# EAGLE design Keyglove Kit v0.3 (EAGLE 6.1)
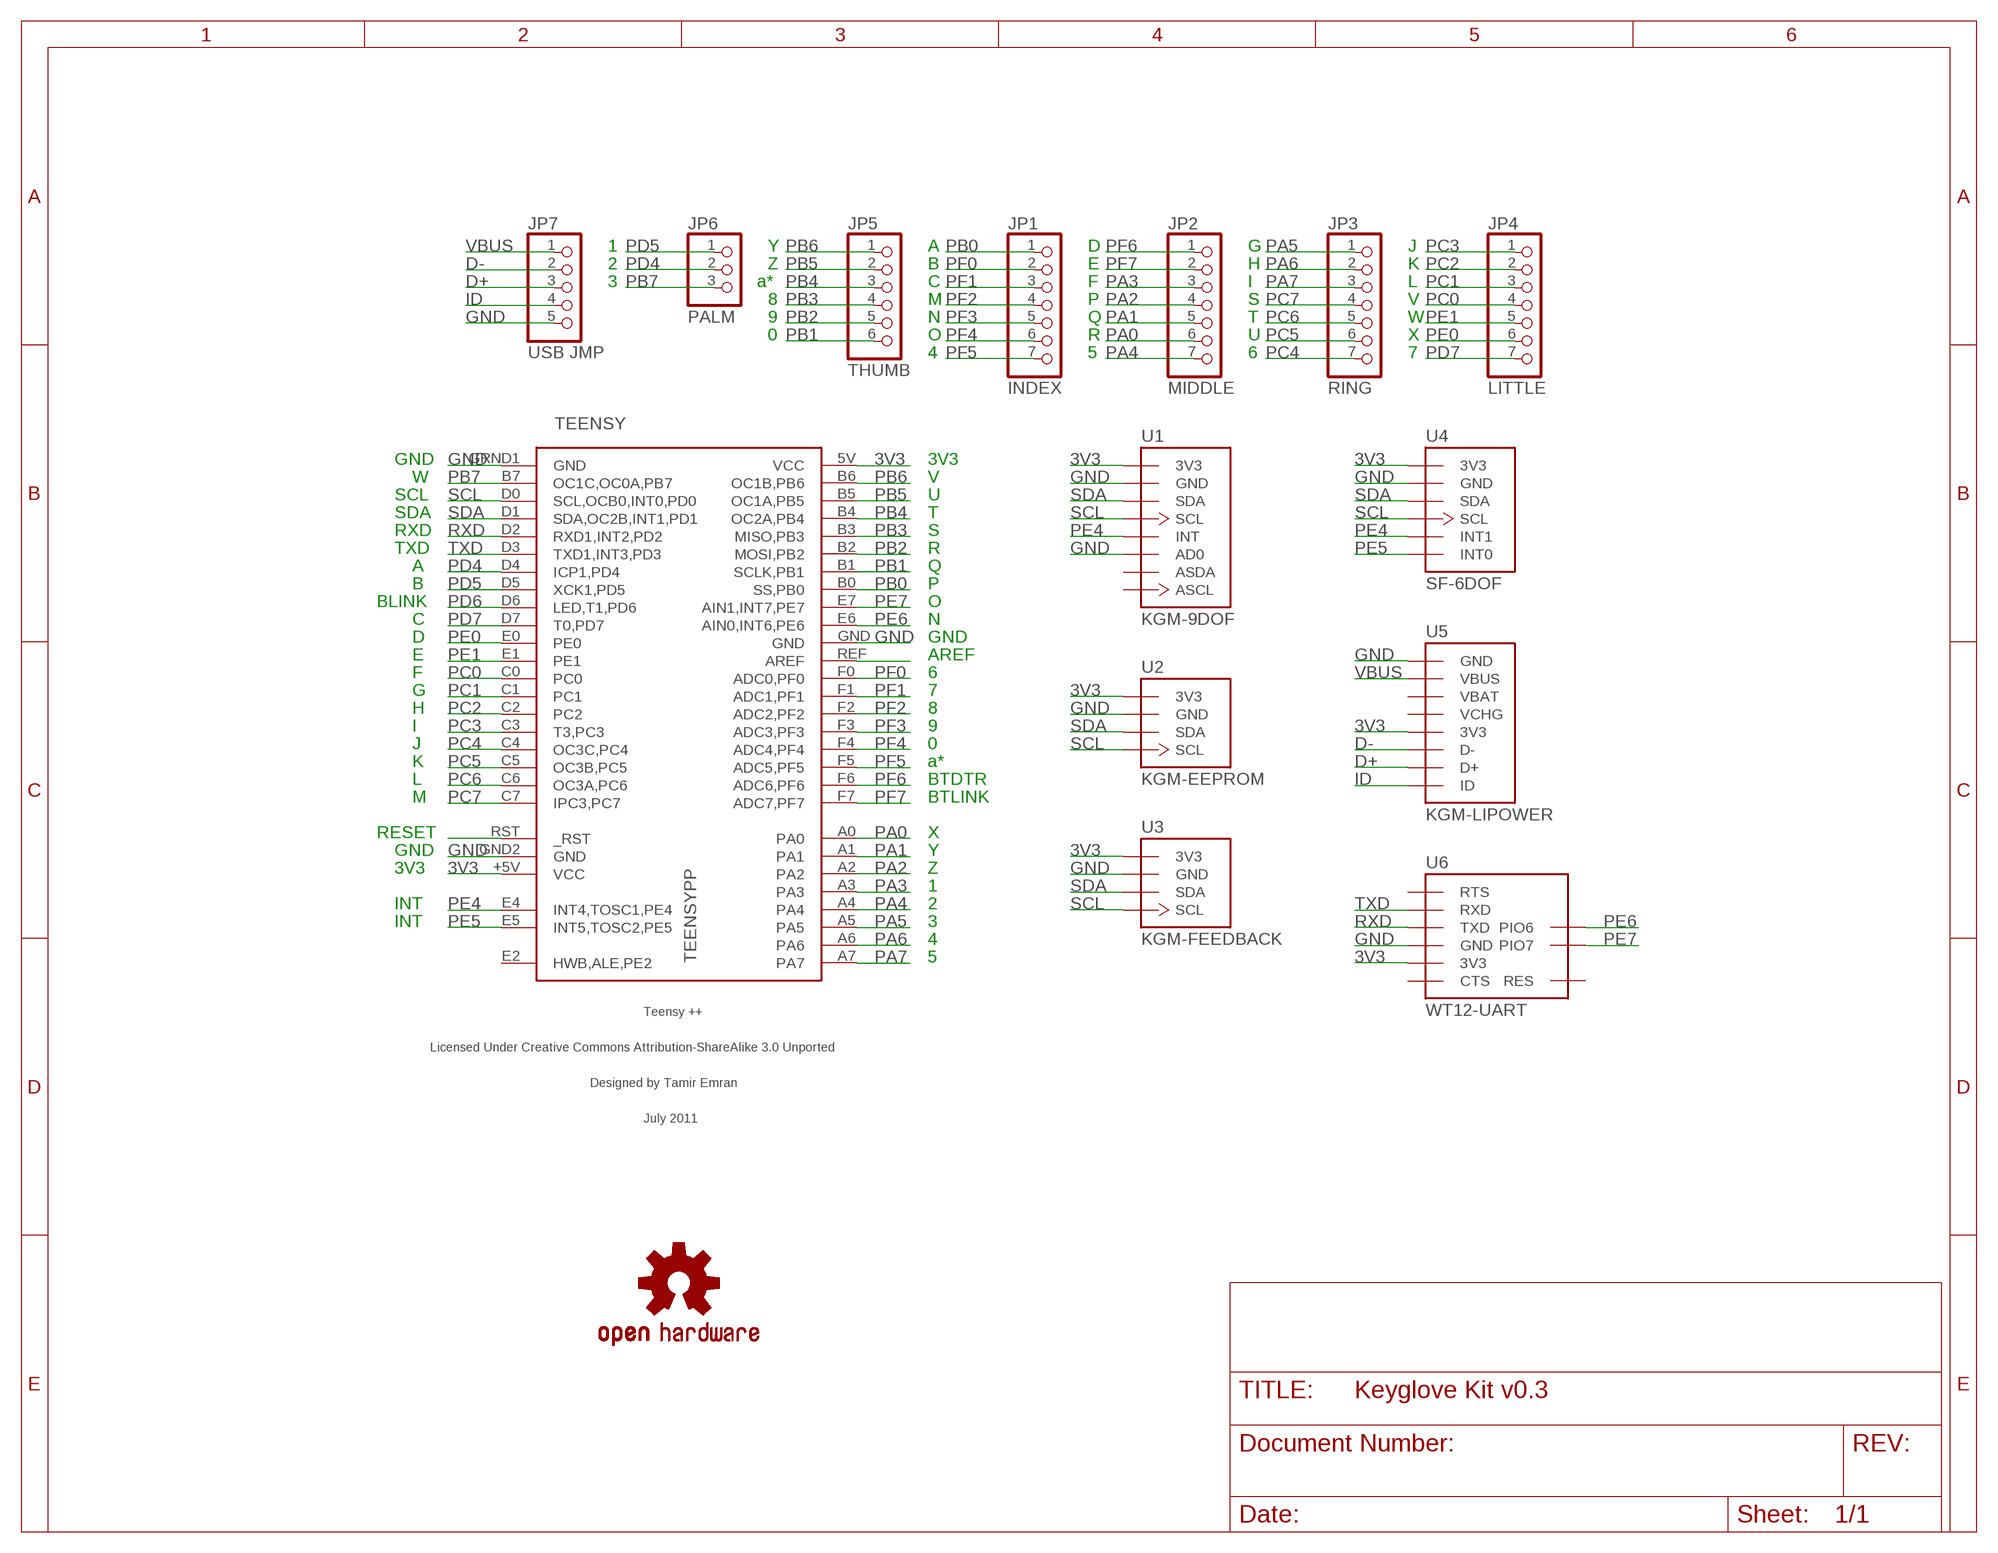
[diagram p0: schematic, sheet 1]

## Parts
JP1  INDEX  PINHD-1X7  [1X07]
JP2  MIDDLE  PINHD-1X7  [1X07]
JP3  RING  PINHD-1X7  [1X07]
JP4  LITTLE  PINHD-1X7  [1X07]
JP5  THUMB  PINHD-1X6  [1X06]
JP6  PALM  PINHD-1X3  [1X03]
JP7  USB JMP  PINHD-1X5  [1X05]
TEENSY  TEENSYPP  [TEENSYPP]
U1  KGM-9DOF  [KGM-9DOF]
U2  KGM-EEPROM  [KGM-EEPROM]
U3  KGM-FEEDBACK  [KGM-FEEDBACK]
U4  SF-6DOF  [SF-6DOF]
U5  KGM-LIPOWER  [KGM-LIPOWER]
U6  WT12-UART  [WT12-UART]
U$1  OSHW-LOGOM  [OSHW-LOGO-M]

## Nets
3V3 [power]: TEENSY.5V(VCC) TEENSY.+5V(VCC) U1.3V3 U2.3V3 U3.3V3 U4.3V3 U5.3V3 U6.3V3
D+: JP7.3 U5.D+
D-: JP7.2 U5.D-
GND [power]: JP7.5 TEENSY.GND TEENSY.GND2(GND) TEENSY.GRND1(GND) U1.AD0 U1.GND U2.GND U3.GND U4.GND U5.GND U6.GND
ID: JP7.4 U5.ID
N$107: TEENSY.RST(_RST)
N$128: TEENSY.REF(AREF)
PA0: JP2.6 TEENSY.A0
PA1: JP2.5 TEENSY.A1
PA2: JP2.4 TEENSY.A2
PA3: JP2.3 TEENSY.A3
PA4: JP2.7 TEENSY.A4
PA5: JP3.1 TEENSY.A5
PA6: JP3.2 TEENSY.A6
PA7: JP3.3 TEENSY.A7
PB0: JP1.1 TEENSY.B0(SS,PB0)
PB1: JP5.6 TEENSY.B1(SCLK,PB1)
PB2: JP5.5 TEENSY.B2(MOSI,PB2)
PB3: JP5.4 TEENSY.B3(MISO,PB3)
PB4: JP5.3 TEENSY.B4(OC2A,PB4)
PB5: JP5.2 TEENSY.B5(OC1A,PB5)
PB6: JP5.1 TEENSY.B6(OC1B,PB6)
PB7: JP6.3 TEENSY.B7(OC1C,OC0A,PB7)
PC0: JP4.4 TEENSY.C0
PC1: JP4.3 TEENSY.C1
PC2: JP4.2 TEENSY.C2
PC3: JP4.1 TEENSY.C3(T3,PC3)
PC4: JP3.7 TEENSY.C4(OC3C,PC4)
PC5: JP3.6 TEENSY.C5(OC3B,PC5)
PC6: JP3.5 TEENSY.C6(OC3A,PC6)
PC7: JP3.4 TEENSY.C7(IPC3,PC7)
PD4: JP6.2 TEENSY.D4(ICP1,PD4)
PD5: JP6.1 TEENSY.D5(XCK1,PD5)
PD6: TEENSY.D6(LED,T1,PD6)
PD7: JP4.7 TEENSY.D7(T0,PD7)
PE0: JP4.6 TEENSY.E0
PE1: JP4.5 TEENSY.E1
PE4: TEENSY.E4(INT4,TOSC1,PE4) U1.INT U4.INT1
PE5: TEENSY.E5(INT5,TOSC2,PE5) U4.INT0
PE6: TEENSY.E6(AIN0,INT6,PE6) U6.PIO6
PE7: TEENSY.E7(AIN1,INT7,PE7) U6.PIO7
PF0: JP1.2 TEENSY.F0(ADC0,PF0)
PF1: JP1.3 TEENSY.F1(ADC1,PF1)
PF2: JP1.4 TEENSY.F2(ADC2,PF2)
PF3: JP1.5 TEENSY.F3(ADC3,PF3)
PF4: JP1.6 TEENSY.F4(ADC4,PF4)
PF5: JP1.7 TEENSY.F5(ADC5,PF5)
PF6: JP2.1 TEENSY.F6(ADC6,PF6)
PF7: JP2.2 TEENSY.F7(ADC7,PF7)
RXD: TEENSY.D2(RXD1,INT2,PD2) U6.TXD
SCL: TEENSY.D0(SCL,OCB0,INT0,PD0) U1.SCL U2.SCL U3.SCL U4.SCL
SDA: TEENSY.D1(SDA,OC2B,INT1,PD1) U1.SDA U2.SDA U3.SDA U4.SDA
TXD: TEENSY.D3(TXD1,INT3,PD3) U6.RXD
VBUS [power]: JP7.1 U5.VBUS
Unconnected: TEENSY.E2(HWB,ALE,PE2) U1.ASCL U1.ASDA U6.CTS U6.RESET(RES) U6.RTS

## Notes on the sheet
- 1 | Y | A | D | G | J
- 2 | Z | B | E | H | K
- 3 | a* | C | F | I | L
- 8 | M | P | S | V
- 9 | N | Q | T | W
- 0 | O | R | U | X
- 4 | 5 | 6 | 7
- GND | 3V3
- W | V
- SCL | U
- SDA | T
- RXD | S
- TXD | R
- A | Q
- B | P
- BLINK | O
- C | N
- D | GND
- E | AREF
- F | 6
- G | 7
- H | 8
- I | 9
- J | 0
- K | a*
- L | BTDTR
- M | BTLINK
- RESET | X
- GND | Y
- 3V3 | Z
- 1
- INT | 2
- INT | 3
- 4
- 5

## Power pins joined to a net without a drawn wire
VBAT: U5.VBAT
VCHG: U5.VCHG

## Library data of the parts
JP1-JP4 = sf-pinhead:PINHD-1X7: PIN HEADER
JP5 = sf-pinhead:PINHD-1X6: PIN HEADER
JP6 = sf-pinhead:PINHD-1X3: PIN HEADER
JP7 = sf-pinhead:PINHD-1X5: PIN HEADER
TEENSY = sf-keyglovekit:TEENSYPP: Teensy++ Teensy++ board by PJRC <http://www.pjrc.com/>. Eagle part designed by Tamir Emran, July 2011. Licensed under Create Commons Attribution-ShareAlike 3.0 Unported license (CC-BY-SA-3.0).
U1 = sf-keyglovekit:KGM-9DOF
U2 = sf-keyglovekit:KGM-EEPROM
U3 = sf-keyglovekit:KGM-FEEDBACK
U4 = sf-keyglovekit:SF-6DOF
U5 = sf-keyglovekit:KGM-LIPOWER
U6 = sf-keyglovekit:WT12-UART
U$1 = SparkFun:OSHW-LOGO: Open Source Hardware Logo This logo indicates the piece of hardware it is found on incorporates a OSHW license and/or adheres to the definition of open source hardware found here: http://freedomdefined.org/OSHW

## Net classes
0 default: width 0.152 mm, drill 0.33 mm, clearance 0.152 mm
1 power: width 0.203 mm, drill 0.33 mm, clearance 0.152 mm

## Board
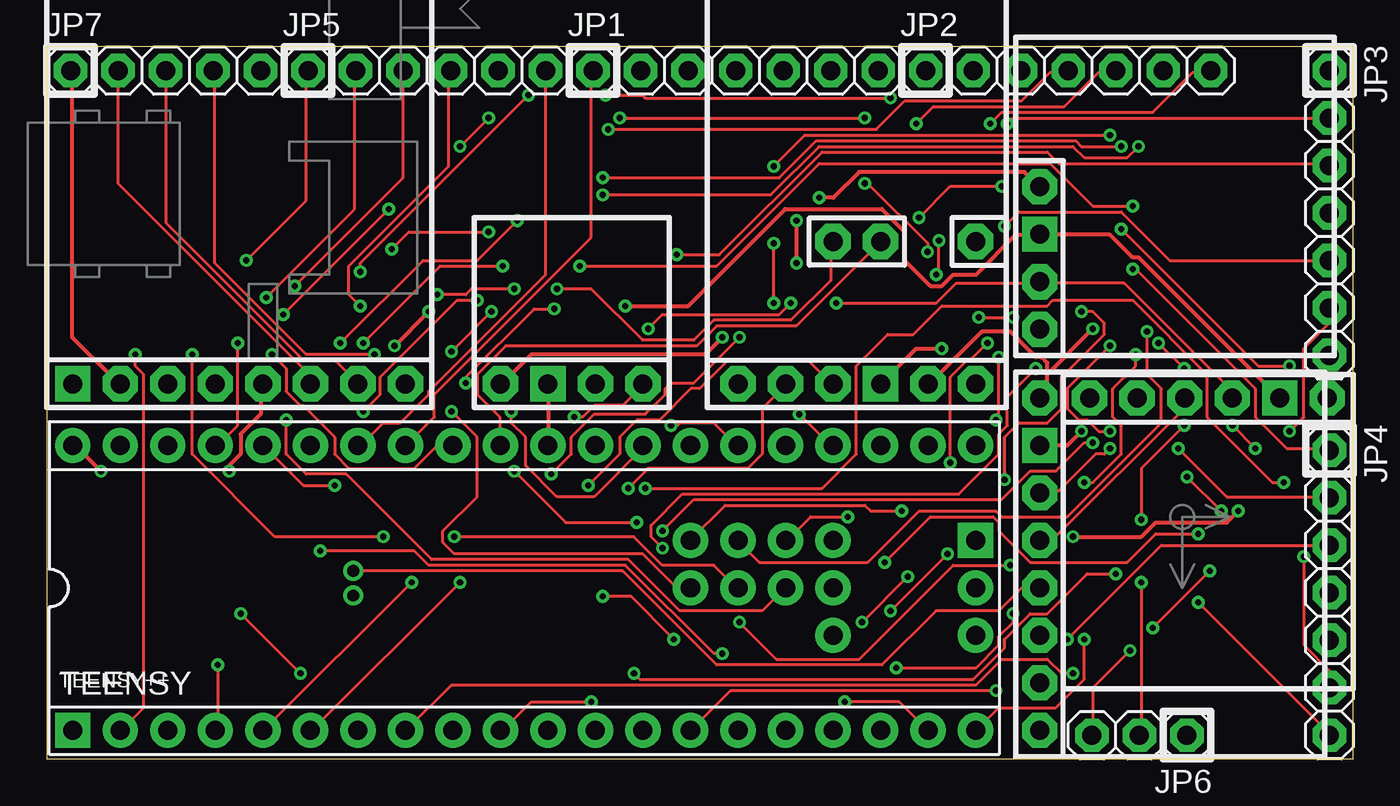
[diagram p1: board, top side]
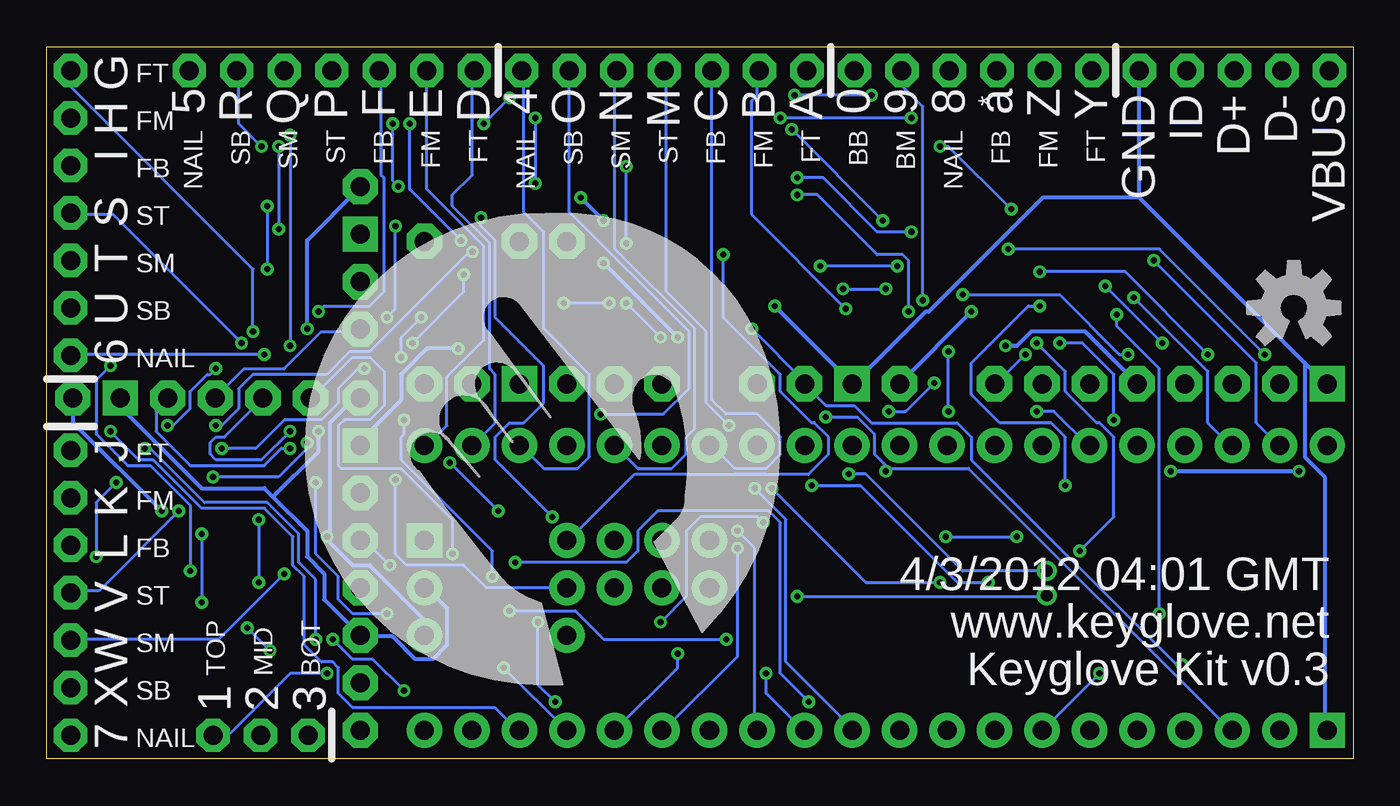
[diagram p2: board, bottom side, seen from below]

Size 69.85 x 38.1 mm. Coordinates in mm from the lower left corner, seen from the top.
Outline: 0,38.1 0,0 69.85,0 69.85,38.1 0,38.1
Copper layers (1*16): Top 0.0356mm / dielectric 1.5011mm / Bottom 0.0356mm
Design rules: minimum track width 6mil, minimum drill 13mil, track to track 6mil, track to pad 6mil, pad to pad 6mil, via to via 6mil, smd to smd 6mil, copper to edge 15mil, drill to drill 6mil, minimum pad ring 7mil, minimum via ring 7mil, stop-mask expansion 4mil, vias tented up to drill 20mil, thermal gap 10mil

### Footprints (pad centres in the part's own frame; a part is rotated, then mirrored left to right if it is on the bottom)
1X07 = drill 1.016 pad 1.778 octagon: 1 -7.62,0; 2 -5.08,0; 3 -2.54,0; 4 0,0; 5 2.54,0; 6 5.08,0; 7 7.62,0
1X06 = drill 1.016 pad 1.778 octagon: 1 -6.35,0; 2 -3.81,0; 3 -1.27,0; 4 1.27,0; 5 3.81,0; 6 6.35,0
1X03 = drill 1.016 pad 1.778 octagon: 1 -2.54,0; 2 0,0; 3 2.54,0
1X05 = drill 1.016 pad 1.778 octagon: 1 -5.08,0; 2 -2.54,0; 3 0,0; 4 2.54,0; 5 5.08,0
TEENSYPP = drill 1.016 pad 1.88: 5V 24.13,-2.54; +5V -24.13,7.62; A0 8.89,0; A1 11.43,0; A2 13.97,0; A3 16.51,0; A4 8.89,2.54; A5 11.43,2.54; A6 13.97,2.54; A7 16.51,2.54; B0 -6.35,7.62; B1 -8.89,7.62; B2 -11.43,7.62; B3 -13.97,7.62; B4 -16.51,7.62; B5 -19.05,7.62; B6 -21.59,7.62; B7 -21.59,-7.62; C0 6.35,-7.62; C1 8.89,-7.62; C2 11.43,-7.62; C3 13.97,-7.62; C4 16.51,-7.62; C5 19.05,-7.62; C6 21.59,-7.62; C7 24.13,-7.62; D0 -19.05,-7.62; D1 -16.51,-7.62; D2 -13.97,-7.62; D3 -11.43,-7.62; D4 -8.89,-7.62; D5 -6.35,-7.62; D6 -3.81,-7.62; D7 -1.27,-7.62; E0 1.27,-7.62; E1 3.81,-7.62; E2 16.51,-2.54; E6 -1.27,7.62; E7 -3.81,7.62; F0 6.35,7.62; F1 8.89,7.62; F2 11.43,7.62; F3 13.97,7.62; F4 16.51,7.62; F5 19.05,7.62; F6 21.59,7.62; F7 24.13,7.62; GND2 24.13,0; GRND1 1.27,7.62; REF 3.81,7.62 | drill 0.635 pad 1.067: E4 -9.144,0.914; E5 -9.144,-0.406 | drill 1.016 pad 1.88 square: GND -24.13,-7.62; RST 24.13,2.54
KGM-9DOF = drill 1.016 pad 1.88 octagon: 3V3 1.27,19.177; AD0 1.27,6.477; ASCL 1.27,1.397; ASDA 1.27,3.937; INT 1.27,9.017; SCL 1.27,11.557; SDA 1.27,14.097 | drill 1.016 pad 1.88 square: GND 1.27,16.637
KGM-EEPROM = drill 1.016 pad 1.88 octagon: 3V3 1.27,9.017; SCL 1.27,1.397; SDA 1.27,3.937 | drill 1.016 pad 1.88 square: GND 1.27,6.477
KGM-FEEDBACK = drill 1.016 pad 1.88 octagon: 3V3 1.27,9.017; SCL 1.27,1.397; SDA 1.27,3.937 | drill 1.016 pad 1.88 square: GND 1.27,6.477
SF-6DOF = drill 1.016 pad 1.88 octagon: 3V3 1.27,14.097; INT0 1.27,1.397; INT1 1.27,3.937; SCL 1.27,6.477; SDA 1.27,9.017 | drill 1.016 pad 1.88 square: GND 1.27,11.557
KGM-LIPOWER = drill 1.016 pad 1.88 octagon: 3V3 1.27,9.017; D+ 1.27,3.937; D- 1.27,6.477; ID 1.27,1.397; VBAT 1.27,14.097; VBUS 1.27,16.637; VCHG 1.27,11.557 | drill 1.016 pad 1.88 square: GND 1.27,19.177
WT12-UART = drill 1.016 pad 1.88 octagon: 3V3 1.27,4.191; CTS 1.27,1.651; PIO6 8.89,6.731; PIO7 8.89,9.271; RESET 8.89,1.651; RTS 1.27,14.351; RXD 1.27,11.811; TXD 1.27,9.271 | drill 1.016 pad 1.88 square: GND 1.27,6.731

### Placement (x,y rotation side)
JP1  36.83,36.83 0 top
JP2  54.61,36.83 0 top
JP3  68.58,29.21 270 top
JP4  68.58,8.89 270 top
JP5  20.32,36.83 0 top
JP6  58.42,1.27 180 top
JP7  6.35,36.83 0 top
TEENSY  25.53,9.14 0 top
U1  51.82,0.13 0 top
U2  33.27,18.8 90 top
U3  51.82,21.59 0 top
U4  54.36,20.57 270 top
U5  20.57,18.8 90 top
U6  51.31,18.8 90 top
U$1  3.17,24.13 0 bottom

### Tracks (layer width: path | path; a pad name or v marks a point on that pad's centre or on a via)
3V3  (via drill 0.33)
  Top 0.203: v2.9,15.39 1.52,16.76 TEENSY.+5V | v9.75,15.39 9.75,15.7 10.36,16.31 10.36,17.37 11.43,18.44 11.43,19.96 U5.3V3 | v18.59,22.1 v20.42,23.93 | 53.19,30.63 U3.3V3 53.03,30.63 52.27,31.39 43.43,31.39 42.06,30.02 v41.3,30.02 | 53.49,20.57 53.49,19.66 53.19,19.36 U1.3V3 | 53.49,20.57 53.49,21.18 53.19,21.49 52.88,21.49 51.51,22.86 49.99,22.86 47.24,20.12 U6.3V3 | v63.7,13.26 63.09,12.65 59.28,12.65 58.52,11.89 v54.86,11.89 | 53.49,20.57 v55.93,23.01 | v36.12,22.55 35.2,21.64 25.91,21.64 24.38,20.12 U2.3V3 | v40.08,28.8 v40.08,26.52
  Bottom 0.203: v9.75,15.39 v2.9,15.39 | v20.42,23.93 24.23,20.12 U2.3V3 | v18.59,22.1 17.98,22.1 17.22,22.86 14.33,22.86 11.58,20.12 U5.3V3 | 54.71,11.89 54.71,17.98 53.49,19.2 53.19,19.2 U1.3V3 | 54.71,11.89 54.71,11.58 53.49,10.36 52.58,10.36 49.68,7.47 49.68,6.71 TEENSY.5V | v63.7,13.26 68.43,17.98 68.43,19.2 U4.3V3 | 54.71,11.89 v54.86,11.89 | v55.93,23.01 55.93,27.74 53.19,30.48 U3.3V3 | v40.08,26.52 v36.12,22.55 | v41.3,30.02 v40.08,28.8
D+
  Top 0.152: JP7.3 6.4,36.73 6.4,28.65 13.72,21.34 15.39,21.34 16.61,20.12 U5.D+
D-
  Top 0.152: JP7.2 3.81,30.79 14.02,20.57 14.02,20.12 U5.D-
GND  (via drill 0.33)
  Top 0.203: v47.85,21.95 46.48,21.95 44.65,20.12 U6.GND | 49.68,9.14 TEENSY.GND2 | U4.GND 65.84,19.36 58.37,26.82 58.06,26.82 56.84,28.04 53.19,28.04 U3.GND 53.03,28.04 51.82,28.04 49.68,25.91 48.46,25.91 47.85,25.3 47.24,25.3 45.87,26.67 45.87,28.19 44.65,29.41 39.47,29.41 34.29,24.23 v30.94,24.23 | U1.GND 54.56,16.76 v55.32,17.53 | TEENSY.GRND1 26.82,16.76 26.82,19.96 U2.GND | 1.52,1.52 TEENSY.GND
  Bottom 0.203: v47.85,21.95 49.53,21.95 50.9,20.57 50.9,19.2 53.03,17.07 53.03,16.76 U1.GND | TEENSY.GND2 49.53,9.14 48.46,8.08 48.46,6.1 49.23,5.33 50.14,5.33 51.36,6.55 53.03,6.55 U1.AD0 55.02,8.53 55.02,9.91 55.93,10.82 55.93,12.19 57.76,14.02 | 57.76,14.02 58.22,14.48 61.57,14.48 65.84,18.75 65.84,19.2 U4.GND | v55.32,17.53 55.32,16.46 57.76,14.02 | 11.43,30.02 JP7.5 | 2.59,21.18 1.52,20.12 U5.GND | 2.59,21.18 11.43,30.02 | 2.59,21.18 2.59,16.15 1.52,15.09 1.52,1.52 TEENSY.GND | 11.43,30.02 16.61,30.02 22.71,23.93 22.86,23.93 26.67,20.12 U2.GND 26.82,20.12 v30.94,24.23
ID  (via drill 0.33)
  Top 0.152: v17.53,21.64 13.87,21.64 8.99,26.52 8.99,36.73 JP7.4
  Bottom 0.152: v17.53,21.64 19.05,20.12 U5.ID
PA0  (via drill 0.33)
  Top 0.152: v58.37,32.77 57.76,32.16 55.47,32.16 54.86,32.77 41.3,32.77 38.71,30.18 v29.72,30.18 | v21.64,21.79 v23.77,23.93 | v21.64,18.59 23.01,17.22 23.01,14.02 21.18,12.19 21.18,11.58 21.79,10.97 31.85,10.97 33.68,9.14 TEENSY.A0
  Bottom 0.152: v58.37,32.77 59.59,33.98 59.59,36.73 JP2.6 | v29.72,30.18 28.65,30.18 25.45,26.98 24.08,26.98 23.77,26.67 v23.77,23.93 | v21.64,18.59 v21.64,21.79
PA1  (via drill 0.33)
  Top 0.152: v46.48,33.98 47.4,34.9 54.41,34.9 56.24,36.73 57.15,36.73 JP2.5 | v45.11,35.36 32,35.36 31.85,35.51 v29.87,35.51 | v25.76,35.51 16.76,26.52 v16.76,26.06 | v7.77,21.64 7.77,16.31 12.19,11.89 v17.98,11.89 | v21.79,11.89 31.39,11.89 32.92,10.36 35.66,10.36 36.88,9.14 TEENSY.A1
  Bottom 0.152: v45.11,35.36 v46.48,33.98 | v25.76,35.51 v29.87,35.51 | v16.76,26.06 12.19,26.06 v7.77,21.64 | v21.79,11.89 v17.98,11.89
PA2  (via drill 0.33)
  Top 0.152: v30.02,33.68 44.35,33.68 45.87,35.2 52.12,35.2 53.65,36.73 54.56,36.73 JP2.4 | v25.15,28.8 23.01,26.67 20.12,26.67 v15.7,22.25 | v12.8,18.14 12.8,16.31 13.87,15.24 16,15.24 20.57,10.67 31.09,10.67 33.83,7.92 38.25,7.92 39.47,9.14 TEENSY.A2
  Bottom 0.152: v25.15,28.8 v30.02,33.68 | v15.7,22.25 14.48,22.25 12.8,20.57 v12.8,18.14
PA3  (via drill 0.33)
  Top 0.152: v55.32,23.93 55.93,23.93 56.54,23.32 56.54,22.71 54.25,20.42 54.25,18.75 53.49,17.98 51.97,17.98 51.21,17.22 v51.21,14.94
  Bottom 0.152: v55.32,23.93 55.02,24.23 52.58,24.23 51.82,24.99 51.82,31.09 51.97,31.24 51.97,36.73 JP2.3 | v51.21,14.94 51.21,10.97 50.6,10.36 47.55,10.36 46.33,9.14 TEENSY.A3
PA4  (via drill 0.33)
  Top 0.152: v50.44,33.98 51.05,34.59 59.13,34.59 61.27,36.73 62.18,36.73 JP2.7 | v47.7,27.74 47.7,26.06 v47.55,25.91 | v50.29,22.25 49.38,21.34 49.23,21.34 48.31,20.42 v48.31,15.85 | v45.72,13.26 44.04,13.26 43.74,13.56 36.27,13.56 34.44,11.73 TEENSY.A4
  Bottom 0.152: v50.44,33.98 50.44,30.48 v47.7,27.74 | v47.55,25.91 47.55,24.99 v50.29,22.25 | v45.72,13.26 v48.31,15.85
PA5  (via drill 0.33)
  Top 0.152: v58.83,22.86 58.83,20.57 59.59,19.81 59.59,17.98 54.56,12.95 51.05,12.95 50.75,13.26 46.63,13.26 43.89,10.52 38.1,10.52 37.03,11.58 TEENSY.A5
  Bottom 0.152: JP3.1 68.58,35.97 58.83,26.21 v58.83,22.86
PA6  (via drill 0.33)
  Top 0.152: JP3.2 51.66,34.29 v51.36,33.98 | v51.05,30.63 48.31,30.63 v46.63,28.96 | v42.82,12.95 40.84,12.95 39.62,11.73 TEENSY.A6
  Bottom 0.152: v51.36,33.98 51.36,30.94 v51.05,30.63 | v46.63,28.96 46.63,28.5 45.87,27.74 45.87,23.62 43.28,21.03 43.28,19.05 44.35,17.98 45.11,17.98 45.87,17.22 45.87,16 v42.82,12.95
PA7  (via drill 0.33)
  Top 0.152: v33.68,26.98 35.97,26.98 41.45,32.46 53.49,32.46 54.1,31.85 68.58,31.85 JP3.3
  Bottom 0.152: v33.68,26.98 33.68,23.62 30.63,20.57 30.63,19.66 28.96,17.98 28.8,17.98 28.04,17.22 28.04,16.31 29.11,15.24 38.41,15.24 41.91,11.73 TEENSY.A7
PB0
  Top 0.152: JP1.1 29.11,36.73 29.11,27.89 20.73,19.51 20.73,18.29 19.2,16.76 TEENSY.B0
PB1
  Top 0.152: JP5.6 26.67,25.91 20.42,19.66 20.42,19.51 18.9,17.98 17.98,17.98 16.76,16.76 TEENSY.B1
PB2  (via drill 0.33)
  Top 0.152: v23.01,24.54 21.95,24.54 17.83,20.42 17.83,19.51 v16.92,18.59
  Bottom 0.152: v23.01,24.54 23.01,34.9 24.08,35.97 24.08,36.73 JP5.5 | v16.92,18.59 16,18.59 14.17,16.76 TEENSY.B2
PB3  (via drill 0.33)
  Top 0.152: v16.76,24.23 16.15,24.84 16.15,26.36 21.49,31.7 21.49,36.73 JP5.4 | v15.39,14.63 13.72,14.63 11.58,16.76 TEENSY.B3
  Bottom 0.152: v16.76,24.23 17.37,24.23 20.42,21.18 20.42,19.51 18.9,17.98 16.15,17.98 15.39,17.22 v15.39,14.63
PB4  (via drill 0.33)
  Top 0.152: JP5.3 19.05,31.09 v13.26,25.3 | v10.21,22.25 10.21,17.83 9.14,16.76 TEENSY.B4
  Bottom 0.152: v10.21,22.25 v13.26,25.3
PB5  (via drill 0.33)
  Top 0.152: v11.73,24.69 16.46,29.41 16.46,36.73 JP5.2
  Bottom 0.152: v11.73,24.69 7.77,20.73 7.77,17.98 6.55,16.76 TEENSY.B5
PB6  (via drill 0.33)
  Top 0.152: v10.67,26.67 13.87,29.87 13.87,36.73 JP5.1
  Bottom 0.152: v10.67,26.67 5.18,21.18 5.18,17.98 3.96,16.76 TEENSY.B6
PB7  (via drill 0.33)
  Top 0.152: v57.91,5.79 55.93,3.81 55.93,1.37 JP6.3 | v62.18,10.06 v59.13,7.01 | v66.45,21.03 64.77,21.03 v57.45,28.35 | v57.45,32.77 55.32,32.77 55.02,33.07 41.15,33.07 39.17,31.09 v29.72,31.09 | v23.62,28.19 19.36,28.19 v18.44,27.28 | v4.72,21.64 4.72,21.03 5.18,20.57 5.18,2.74 3.96,1.52 TEENSY.B7
  Bottom 0.152: v59.13,7.01 v57.91,5.79 | v62.18,10.06 62.18,13.56 64.31,15.7 65.53,15.7 67.21,17.37 67.21,20.27 v66.45,21.03 | v57.45,32.77 v57.45,28.35 | v29.72,31.09 28.35,31.09 25.45,28.19 v23.62,28.19 | v18.44,27.28 10.36,27.28 v4.72,21.64
PC0  (via drill 0.33)
  Top 0.152: v60.96,15.09 v62.79,13.26 | v55.93,16.92 55.47,16.92 53.95,15.39 52.58,15.39 51.05,13.87 34.59,13.87 v32.92,12.19
  Bottom 0.152: v62.79,13.26 67.06,8.99 68.58,8.99 JP4.4 | v60.96,15.09 57.45,15.09 55.93,16.61 v55.93,16.92 | v32.92,12.19 32,11.28 32,1.52 TEENSY.C0
PC1  (via drill 0.33)
  Top 0.152: JP4.3 59.59,11.43 v54.56,6.4 | v50.75,3.66 36.58,3.66 34.44,1.52 TEENSY.C1
  Bottom 0.152: v54.56,6.4 53.49,5.33 52.43,5.33 v50.75,3.66
PC2  (via drill 0.33)
  Top 0.152: v60.5,16.61 63.09,14.02 68.58,14.02 JP4.2 | v52.88,20.88 51.36,19.36 51.36,17.83 50.9,17.37 50.9,16.31 48.77,14.17 33.98,14.17 32.31,12.5 32.31,11.89 v32.92,11.28
  Bottom 0.152: v60.5,16.61 58.67,16.61 57.15,18.14 55.17,18.14 54.25,19.05 54.25,19.81 53.19,20.88 v52.88,20.88 | v32.92,11.28 32.92,5.49 36.88,1.52 TEENSY.C2
PC3  (via drill 0.33)
  Top 0.152: v58.06,26.21 58.22,26.21 64.62,19.81 64.62,18.29 66.29,16.61 68.58,16.61 JP4.1 | v58.06,29.57 55.93,29.57 53.65,31.85 41.3,31.85 35.81,26.36 v28.5,26.36 | v24.38,26.36 21.03,26.36 v16.92,22.25 | v14.63,11.12 19.66,11.12 20.42,10.36 30.94,10.36 35.66,5.64 v36.12,5.64
  Bottom 0.152: v58.06,29.57 v58.06,26.21 | v24.38,26.36 v28.5,26.36 | v16.92,22.25 15.39,20.73 15.39,19.66 13.72,17.98 13.56,17.98 12.8,17.22 12.8,12.95 v14.63,11.12 | v36.12,5.64 36.12,4.88 39.47,1.52 TEENSY.C3
PC4  (via drill 0.33)
  Top 0.152: v58.22,21.64 58.22,21.03 57,19.81 57,18.29 57.45,17.83 57.45,16.31 55.93,14.78 v55.47,14.78 | v51.66,7.77 51.66,7.32 50.9,6.55 50.9,6.1 49.68,4.88 v45.41,4.88
  Bottom 0.152: v58.22,21.64 68.58,21.64 JP3.7 | v55.47,14.78 55.47,10.97 54.25,9.75 54.25,8.53 53.49,7.77 v51.66,7.77 | v45.41,4.88 42.06,1.52 TEENSY.C4
PC5  (via drill 0.33)
  Top 0.152: JP3.6 68.58,23.32 67.21,21.95 67.21,18.29 v66.45,17.53
  Bottom 0.152: v66.45,17.53 64.92,16 64.16,16 61.57,13.41 58.22,13.41 56.69,11.89 56.69,10.36 56.08,9.75 56.08,6.1 55.17,5.18 54.56,5.18 54.25,4.88 54.25,3.5 53.49,2.74 45.87,2.74 44.65,1.52 TEENSY.C5
PC6  (via drill 0.33)
  Top 0.152: JP3.5 60.05,26.67 57.45,29.26 51.97,29.26 v51.21,28.5 | v49.84,23.62 v51.66,23.62 | v50.9,21.49 50.9,18.29 v50.75,18.14 | v43.59,7.32 v46.02,9.75 | v42.67,3.05 45.57,3.05 47.09,1.52 TEENSY.C6
  Bottom 0.152: v51.21,28.5 51.21,24.08 v51.66,23.62 | v49.84,23.62 50.9,22.55 v50.9,21.49 | v50.75,18.14 50.75,17.37 50.9,17.22 50.9,16 46.02,11.12 v46.02,9.75 | v43.59,7.32 43.59,3.96 v42.67,3.05
PC7  (via drill 0.33)
  Top 0.152: v60.81,20.88 v59.44,22.25 | v64.62,16.61 v63.4,17.83 | v55.47,6.4 55.47,4.27 53.95,2.74 50.9,2.74 49.68,1.52 TEENSY.C7
  Bottom 0.152: v59.44,22.25 66.29,29.11 68.58,29.11 JP3.4 | v60.81,20.88 61.11,20.57 61.27,20.57 62.18,19.66 62.18,18.75 63.09,17.83 v63.4,17.83 | v64.62,16.61 64.31,16.61 61.42,13.72 58.06,13.72 56.39,12.04 56.39,10.52 55.47,9.6 v55.47,6.4
PD4  (via drill 0.33)
  Top 0.152: v58.52,9.45 58.52,1.37 JP6.2 | v58.52,12.8 58.52,15.54 v60.81,17.83 | v47.09,27.13 47.09,27.58 43.89,30.79 v43.74,30.79 | v30.63,34.29 v43.74,34.29 | v22.1,32.77 v23.62,34.29 | v12.65,23.77 v18.29,29.41 | v13.56,4.57 v10.36,7.77
  Bottom 0.152: v58.52,12.8 v58.52,9.45 | v60.81,17.83 60.5,17.83 59.59,18.75 59.59,19.81 58.83,20.57 54.86,20.57 53.65,21.79 52.58,21.79 47.24,27.13 v47.09,27.13 | v43.74,34.29 v43.74,30.79 | v23.62,34.29 v30.63,34.29 | v22.1,32.77 21.64,32.77 v18.29,29.41 | v12.65,23.77 12.65,23.16 10.36,20.88 v10.36,7.77 | v13.56,4.57 16.61,1.52 TEENSY.D4
PD5  (via drill 0.33)
  Top 0.152: v54.86,4.57 54.25,4.57 53.49,5.33 51.05,5.33 49.68,3.96 21.64,3.96 19.2,1.52 TEENSY.D5
  Bottom 0.152: v54.86,4.57 56.84,4.57 60.05,1.37 60.96,1.37 JP6.1
PD7  (via drill 0.33)
  Top 0.152: v61.57,8.38 68.58,1.37 JP4.7 | v61.57,12.04 59.28,12.04 57.76,10.52 52.58,10.52 50.9,12.19 50.9,12.65 50.6,12.95 47.24,12.95 v44.81,10.52 | v29.11,3.05 25.91,3.05 24.38,1.52 TEENSY.D7
  Bottom 0.152: v61.57,12.04 v61.57,8.38 | v44.81,10.52 38.86,10.52 38.25,11.12 38.25,12.19 37.19,13.26 31.24,13.26 30.63,12.65 30.63,4.57 v29.11,3.05
PE0  (via drill 0.33)
  Top 0.152: JP4.6 68.58,4.72 67.21,6.1 v67.21,10.82 | v66.14,14.78 65.53,14.78 62.03,18.29 62.03,20.57 58.06,24.54 53.8,24.54 53.49,24.23 47.85,24.23 46.33,22.71 44.96,22.71 43.28,21.03 43.28,16.31 41.45,14.48 v32,14.48
  Bottom 0.152: v67.21,10.82 67.21,13.72 v66.14,14.78 | v32,14.48 30.33,12.8 30.33,5.18 26.67,1.52 TEENSY.E0
PE1  (via drill 0.33)
  Top 0.152: v57.15,9.91 55.63,9.91 53.49,7.77 52.58,7.77 51.21,6.4 51.21,5.94 49.53,4.27 31.7,4.27 v31.39,4.57
  Bottom 0.152: v57.15,9.91 60.66,6.4 68.58,6.4 JP4.5 | v31.39,4.57 31.39,3.5 29.41,1.52 TEENSY.E1
PE4  (via drill 0.33)
  Top 0.152: TEENSY.E4 30.79,10.06 35.81,5.03 44.65,5.03 47.55,7.92 50.9,7.92 52.12,9.14 U1.INT | v56.84,17.53 56.24,17.53 55.63,18.14 55.17,18.14 54.56,18.75 54.56,19.81 v56.84,22.1 | v56.84,33.38 40.54,33.38 v38.86,31.7 | v38.86,24.38 v38.86,27.58 | v37.03,22.55 34.59,20.12 33.38,20.12 33.07,19.81 33.07,19.51 32,18.44 29.26,18.44 28.04,17.22 28.04,16.31 v26.98,15.24
  Bottom 0.152: v56.84,17.53 58.37,16 60.81,16 61.11,16.31 61.11,16.92 60.81,17.22 60.35,17.22 58.37,19.2 U4.INT1 | v56.84,33.38 v56.84,22.1 | v38.86,27.58 v38.86,31.7 | v37.03,22.55 v38.86,24.38 | v26.98,15.24 26.06,15.24 20.88,10.06 TEENSY.E4
PE5  (via drill 0.33)
  Top 0.152: v29.72,8.69 31.24,8.69 v33.53,6.4 | v48.16,10.97 v45.11,7.92
  Bottom 0.152: v29.72,8.69 16.46,8.69 TEENSY.E5 | v33.53,6.4 40.08,6.4 41.6,7.92 v45.11,7.92 | v48.16,10.97 48.16,12.8 50.9,15.54 54.1,15.54 54.25,15.7 54.25,17.83 53.95,18.14 52.58,18.14 51.82,18.9 51.82,20.73 52.58,21.49 53.49,21.49 55.63,19.36 U4.INT0
PE6
  Top 0.152: TEENSY.E6 24.23,16.76 24.23,18.29 23.01,19.51 23.01,20.57 24.54,22.1 34.75,22.1 35.81,23.16 40.08,23.16 44.5,27.58 U6.PIO6
PE7  (via drill 0.33)
  Top 0.152: TEENSY.E7 20.88,16.76 19.66,15.54 16.15,15.54 15.39,16.31 15.39,17.22 13.72,18.9 13.56,18.9 12.8,19.66 12.8,20.88 v12.04,21.64 | v20.88,24.84 22.4,24.84 22.71,25.15 v24.99,25.15 | v27.28,25.15 29.11,25.15 31.85,22.4 34.59,22.4 35.66,23.47 39.78,23.47 41.91,25.6 41.91,27.58 U6.PIO7
  Bottom 0.152: v12.04,21.64 12.5,21.64 15.7,24.84 v20.88,24.84 | v27.28,25.15 v24.99,25.15
PF0  (via drill 0.33)
  Top 0.152: v27.13,24.08 26.06,24.08 22.4,20.42 v22.4,20.12 | v24.84,18.59 24.84,17.98 25.6,17.22 25.6,15.7 27.28,14.02 29.26,14.02 32,16.76 TEENSY.F0
  Bottom 0.152: v27.13,24.08 32.16,29.11 32.16,35.2 31.85,35.51 31.85,36.73 JP1.2 | v22.4,20.12 23.93,18.59 v24.84,18.59
PF1
  Bottom 0.152: JP1.3 34.29,19.2 33.53,18.44 31.85,18.44 30.63,17.22 30.63,16.31 31.39,15.54 33.07,15.54 34.29,16.76 TEENSY.F1
PF2  (via drill 0.33)
  Top 0.152: v33.38,17.83 33.68,17.83 33.83,17.98 35.66,17.98 36.88,16.76 TEENSY.F2
  Bottom 0.152: v33.38,17.83 34.59,19.05 34.59,22.86 36.73,24.99 36.73,36.73 JP1.4
PF3
  Bottom 0.152: JP1.5 39.47,36.73 39.47,27.28 35.2,23.01 35.2,17.68 35.66,17.22 35.66,16.31 36.42,15.54 38.25,15.54 39.47,16.76 TEENSY.F3
PF4  (via drill 0.33)
  Top 0.152: v40.23,18.44 41.91,16.76 TEENSY.F4
  Bottom 0.152: JP1.6 41.91,29.26 35.51,22.86 35.51,19.81 36.88,18.44 v40.23,18.44
PF5
  Bottom 0.152: JP1.7 44.35,36.73 44.35,29.26 43.28,28.19 43.28,23.01 40.84,20.57 40.84,16.15 41.45,15.54 43.28,15.54 44.5,16.76 TEENSY.F5
PF6
  Bottom 0.152: JP2.1 47.09,36.73 47.09,31.24 48.16,30.18 48.16,29.57 46.18,27.58 46.18,20.88 45.87,20.57 45.87,17.98 47.09,16.76 TEENSY.F6
PF7
  Bottom 0.152: JP2.2 49.53,30.48 46.48,27.43 46.48,22.4 48.46,20.42 48.46,17.83 49.53,16.76 TEENSY.F7
RXD  (via drill 0.33)
  Top 0.152: v19.51,9.45 11.58,1.52 TEENSY.D2 | v28.96,14.63 30.63,16.31 30.63,17.22 31.55,18.14 32.77,18.14 34.44,19.81 34.9,19.81 36.42,21.34 40.69,21.34 41.91,20.12 U6.TXD
  Bottom 0.152: v19.51,9.45 21.18,9.45 26.36,14.63 v28.96,14.63
SCL  (via drill 0.33)
  Top 0.152: U1.SCL 53.19,11.73 53.8,11.73 60.81,18.75 60.81,19.2 U4.SCL | v28.19,18.29 28.65,18.29 29.26,18.9 30.79,18.9 31.85,19.96 U2.SCL | v51.51,10.36 48.46,10.36 43.43,5.33 39.01,5.33 v37.03,7.32 | v31.55,12.65 27.74,12.65 v24.99,15.39
  Bottom 0.152: U3.SCL 53.19,22.86 55.17,22.86 57.15,20.88 59.28,20.88 60.81,19.36 U4.SCL | 24.84,15.54 20.57,15.54 6.55,1.52 TEENSY.D0 | 24.84,15.54 25.6,16.31 25.6,17.37 26.52,18.29 v28.19,18.29 | v51.51,10.36 52.73,11.58 53.03,11.58 U1.SCL | v37.03,7.32 35.66,8.69 35.66,12.19 34.9,12.95 31.85,12.95 v31.55,12.65 | 24.84,15.54 v24.99,15.39
SDA  (via drill 0.33)
  Top 0.152: v56.84,16.61 56.54,16.31 56.08,16.31 54.1,14.33 53.19,14.33 U1.SDA | U4.SDA 63.25,19.36 63.25,19.81 57.61,25.45 53.19,25.45 U3.SDA 53.03,25.45 48.62,25.45 47.55,24.38 v42.22,24.38 | v9.14,5.03 9.14,1.52 TEENSY.D1 | v39.78,24.38 39.17,23.77 32.92,23.77 v32.16,23.01
  Bottom 0.152: v56.84,16.61 57.3,16.61 58.22,15.7 62.18,15.7 64.01,17.53 64.01,18.59 63.4,19.2 U4.SDA | v9.14,5.03 9.45,5.03 20.42,16 20.42,17.22 21.18,17.98 25.76,17.98 26.67,18.9 28.19,18.9 29.26,19.96 U2.SDA 29.26,20.12 v32.16,23.01 | v39.78,24.38 v42.22,24.38
TXD  (via drill 0.33)
  Top 0.152: v22.1,9.45 14.17,1.52 TEENSY.D3 | v31.09,14.48 32.16,15.54 37.49,15.54 38.25,16.31 38.25,18.75 39.47,19.96 U6.RXD
  Bottom 0.152: v22.1,9.45 26.06,9.45 v31.09,14.48
VBUS
  Top 0.203: JP7.1 1.37,36.73 1.37,22.55 3.81,20.12 U5.VBUS

### Text on the board
tPlace: TEENSY++
bPlace: G | VBUS | D- | D+ | ID | GND | Y | Z | a | 8 | 9 | 0 | A | B | C | M | N | O | 4 | D | E | F | P | Q | R | 5 | FT | * | H | FT | FM | FB | NAIL | BM | BB | FT | FM | FB | ST | SM | SB | NAIL | FT | FM | FB | ST | SM | SB | NAIL | FM | I | FB | S | ST | T | SM | U | SB | 6 | NAIL | J | FT | K | FM | L | 4/3/2012 04:01 GMT | FB | V | www.keyglove.net | ST | W | Keyglove Kit v0.3 | SM | BOT | MID | TOP | X | 3 | 2 | 1 | SB | 7 | NAIL